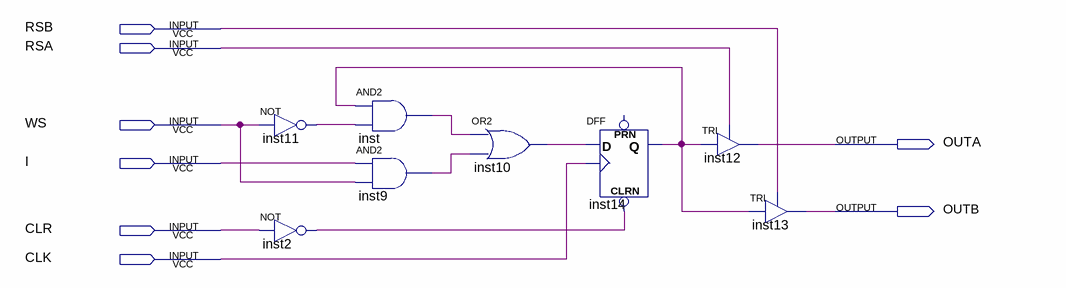
[diagram p0: schematic sheet]
// Quartus schematic RFC.bdf as structural Verilog: 8 symbols, 8 pins
module RFC (
  input  RSB,
  input  RSA,
  input  WS,
  input  I,
  input  CLR,
  input  CLK,
  output OUTA,
  output OUTB
);

  wire inst2_out, inst9_out, inst10_out, inst11_out, inst14_q, inst_out;

  not inst11 (inst11_out, WS);
  not inst2 (inst2_out, CLR);
  and inst (inst_out, inst14_q, inst11_out);
  and inst9 (inst9_out, I, WS);
  or inst10 (inst10_out, inst_out, inst9_out);
  DFF inst14 (.CLRN(inst2_out), .CLK(CLK), .D(inst10_out), .Q(inst14_q));  // open: PRN
  TRI inst12 (.IN(inst14_q), .OE(RSA), .OUT(OUTA));
  TRI inst13 (.IN(inst14_q), .OE(RSB), .OUT(OUTB));
endmodule
